# Altium schematic sheet RADC-BackupPower-S08-V00.SchDoc
size A4; SheetNumber: 8; SheetTotal: 8
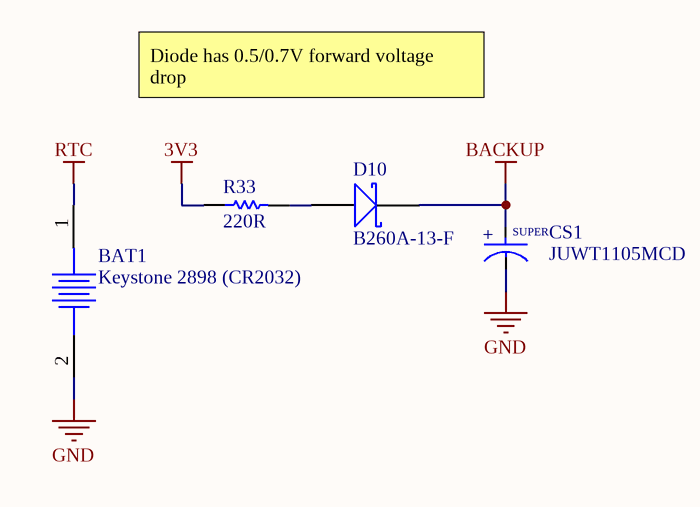
[diagram p0: RADC-BackupPower-S08-V00.SchDoc]

## Parts
BAT1  Keystone 2898 (CR2032)  [Keystone 2898]
CS1  JUWT1105MCD  [CAP_ALU_6.3mmD_9mmL]
D10  B260A-13-F  [SMA]
R33  220R  [Res_ThinFilm_0603]

## Nets
3V3: R33.1
BACKUP: CS1.A D10.K
GND: BAT1.2 CS1.K
RTC: BAT1.1
NetD10_A: D10.A R33.2

## Notes on the sheet
- Diode has 0.5/0.7V forward voltage drop
  3V3 - 0V5 = 2V7 (Right cap voltage)
- (in symbol JUWT1105MCD) +; SUPER

## Library data of the parts
BAT1 = Keystone 2898: Battery Retainer Coin, 20.0mm 1 Cell SMD (SMT) Tab
CS1 = JUWT1105MCD: 1F (EDLC) Supercapacitor 2.7V Radial, Can 4Ohm @ 1kHz 1000 Hrs @ 70°C
D10 = B260A-13-F: Diode, Schottky Barrier Rectifier, 60 V, 2 A, B260A-13-F
R33 = 220R 5% 0603: Resistor, SMD, 220R, 0.1W, 5%, 0603